# Altium schematic sheet Display_7Seg.SchDoc: Display LCD de 7 Segmentos
size A4; Author: **; CompanyName: Introducción al Diseño de Circuitos Impresos; Organization: UTN FRBA; DocumentNumber: 7; Revision: 01; SheetNumber: 7; SheetTotal: 9; Autor: Eugenia Ipar
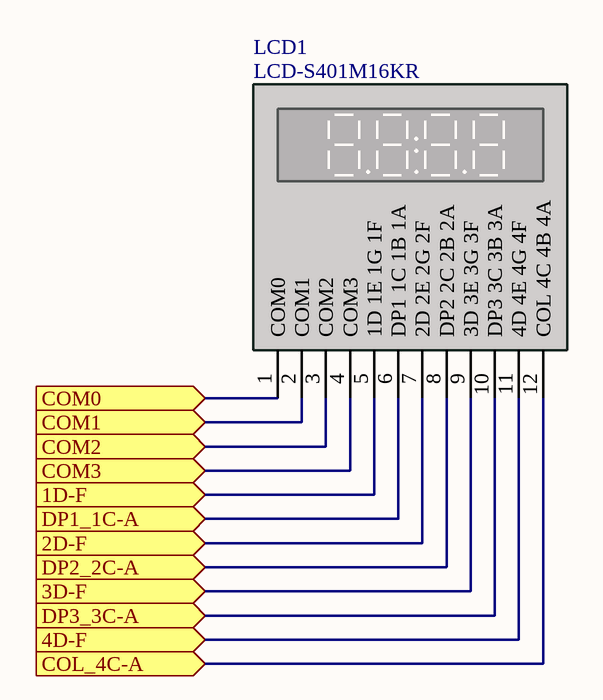
[diagram p0: Display_7Seg.SchDoc]

## Parts
LCD1  LCD-S401M16KR  [7 SEG]

## Ports
1D-F (in), 2D-F (in), 3D-F (in), 4D-F (in), COL_4C-A (in), COM0 (in), COM1 (in), COM2 (in), COM3 (in), DP1_1C-A (in), DP2_2C-A (in), DP3_3C-A (in)

## Nets
1D-F: LCD1.5(1D_1E_1G_1F) ; port 1D-F
2D-F: LCD1.7(2D_2E_2G_2F) ; port 2D-F
3D-F: LCD1.9(3D_3E_3G_3F) ; port 3D-F
4D-F: LCD1.11(4D_4E_4G_4F) ; port 4D-F
COL_4C-A: LCD1.12(COL_4C_4B_4A) ; port COL_4C-A
COM0: LCD1.1(COM0) ; port COM0
COM1: LCD1.2(COM1) ; port COM1
COM2: LCD1.3(COM2) ; port COM2
COM3: LCD1.4(COM3) ; port COM3
DP1_1C-A: LCD1.6(DP1_1C_1B_1A) ; port DP1_1C-A
DP2_2C-A: LCD1.8(DP2_2C_2B_2A) ; port DP2_2C-A
DP3_3C-A: LCD1.10(DP3_3C_3B_3A) ; port DP3_3C-A

## Notes on the sheet
- Title:
- Size:
- Author:
- A4
- Sheet
- of
- Revision:
- File:
- Date:

## Library data of the parts
LCD1 = LCD Display 7-Seg: Lumex LCD Numeric Display 7-Seg 4 Digit S401M16KR